# Altium schematic sheet mcu.SchDoc
size A; SheetNumber: 7; SheetTotal: 12
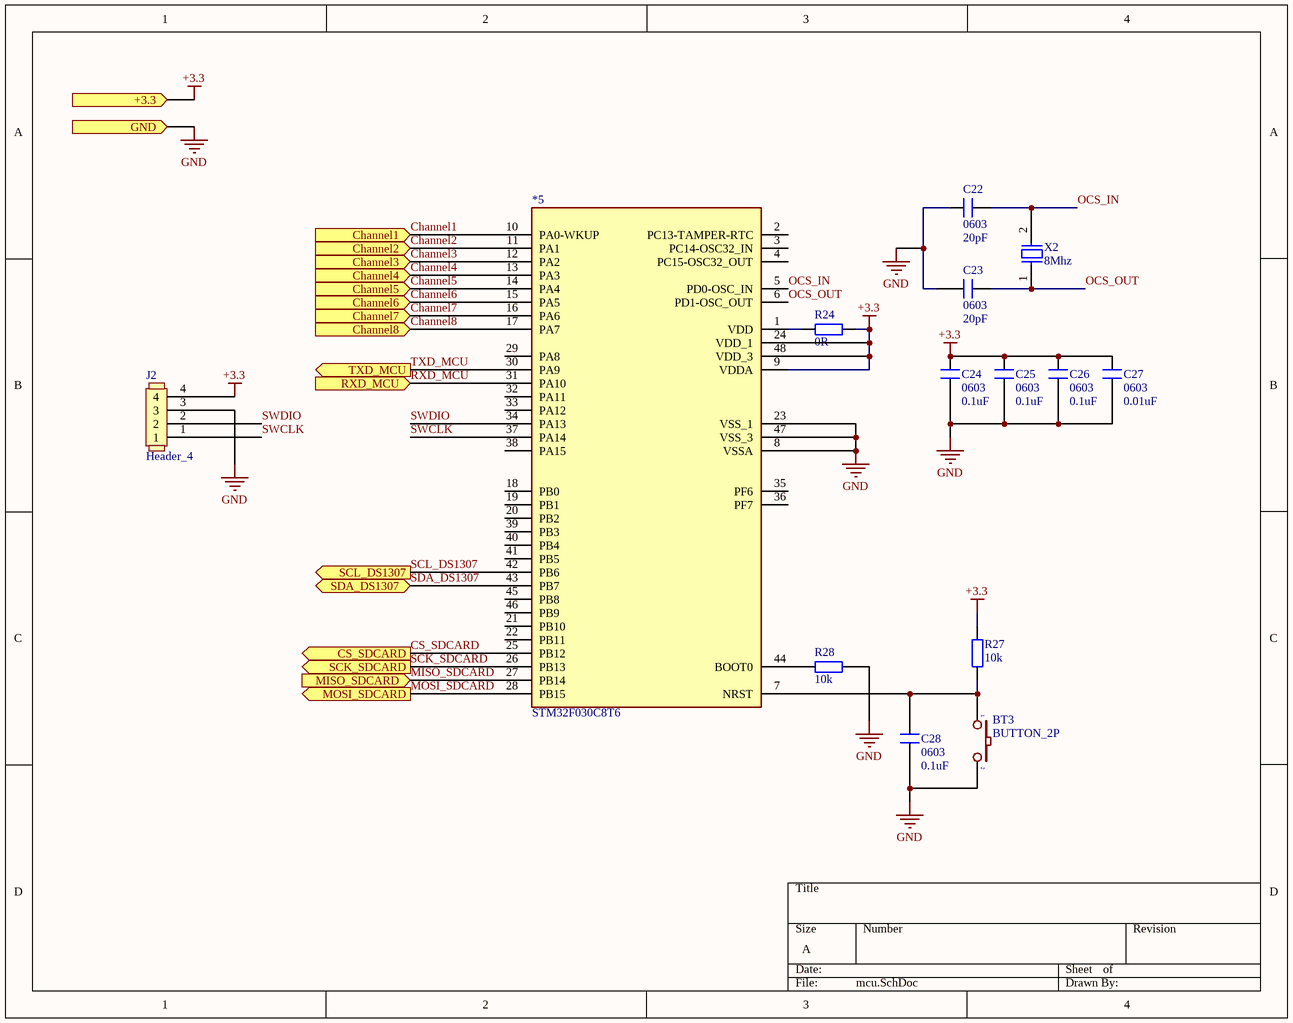
[diagram p0: mcu.SchDoc]

## Parts
*5  STM32F030C8T6  [STM32_LQPF48]
BT3  BUTTON_2P  [BUTTON_2P_SMD]
C22  0603  value 20pF  [C_0603]
C23  0603  value 20pF  [C_0603]
C24  0603  value 0.1uF  [C_0603]
C25  0603  value 0.1uF  [C_0603]
C26  0603  value 0.1uF  [C_0603]
C27  0603  value 0.01uF  [C_0603]
C28  0603  value 0.1uF  [C_0603]
J2  Header_4  [HEADER_4_2P54_SHROUDED]
R24  0R  [tro smd 0603]
R27  10k  [tro smd 0805]
R28  10k  [tro smd 0805]
X2  8Mhz  [XTAL_SMD_3P5]

## Ports
+3.3 (in), Channel1 (in), Channel2 (in), Channel3 (in), Channel4 (in), Channel5 (in), Channel6 (in), Channel7 (in), Channel8 (in), CS_SDCARD (out), GND (in), MISO_SDCARD (in), MOSI_SDCARD (out), RXD_MCU (in), SCK_SDCARD (out), SCL_DS1307 (out), SDA_DS1307 (bidir), TXD_MCU (out)

## Nets
+3.3: *5.9(VDDA) *5.24(VDD_1) *5.48(VDD_3) C24.2 C25.2 C26.2 C27.2 J2.4 R24.1 R27.2 ; port +3.3
GND: *5.8(VSSA) *5.23(VSS_1) *5.47(VSS_3) BT3.2 C22.2 C23.2 C24.1 C25.1 C26.1 C27.1 C28.1 J2.3 R28.1 ; port GND
Channel1: *5.10(PA0-WKUP) ; port Channel1
Channel2: *5.11(PA1) ; port Channel2
Channel3: *5.12(PA2) ; port Channel3
Channel4: *5.13(PA3) ; port Channel4
Channel5: *5.14(PA4) ; port Channel5
Channel6: *5.15(PA5) ; port Channel6
Channel7: *5.16(PA6) ; port Channel7
Channel8: *5.17(PA7) ; port Channel8
CS_SDCARD: *5.25(PB12) ; port CS_SDCARD
MISO_SDCARD: *5.27(PB14) ; port MISO_SDCARD
MOSI_SDCARD: *5.28(PB15) ; port MOSI_SDCARD
OCS_IN: *5.5(PD0-OSC_IN) C22.1 X2.2
OCS_OUT: *5.6(PD1-OSC_OUT) C23.1 X2.1
RXD_MCU: *5.31(PA10) ; port RXD_MCU
SCK_SDCARD: *5.26(PB13) ; port SCK_SDCARD
SCL_DS1307: *5.42(PB6) ; port SCL_DS1307
SDA_DS1307: *5.43(PB7) ; port SDA_DS1307
SWCLK: *5.37(PA14) J2.1
SWDIO: *5.34(PA13) J2.2
TXD_MCU: *5.30(PA9) ; port TXD_MCU
Net*5_1: *5.1(VDD) R24.2
Net*5_7: *5.7(NRST) BT3.1 C28.2 R27.1
Net*5_44: *5.44(BOOT0) R28.2

Not connected (* = marked no-connect by the designer): *5 2(PC13-TAMPER-RTC) 3(PC14-OSC32_IN) 4(PC15-OSC32_OUT) 18(PB0) 19(PB1) 20(PB2) 21(PB10) 22(PB11) 29(PA8) 32(PA11) 33(PA12) 35(PF6) 36(PF7) 38(PA15) 39(PB3) 40(PB4) 41(PB5) 45(PB8) 46(PB9)

## Library data of the parts
BT3 = BUTTON_2P: Manufacturer: C&K; Part Number: PTS636 SM25F SMTR LFS; Part Code: S2000-000001; Point: 2; Value: BUTTON_2P; Description SEL: BUTTON_2P; Footprint Type: TH
C22 C23 = Cap_Cer_0603_18pF: Ceramic Capacitor 0603  (+-10% TH)/(+10%SMD); Manufacturer: Murata Electronics; Part Number: GRM1885C1H180JA01J; Part Code: S1200-000093; Description SEL: CAP CER 18PF 50V C0G/NP0 0603; Point: 2; Footprint Type: SMD
C24-C28 = Cap_Cer_0603_0.1uF_25V: Ceramic Capacitor 0603  (+-10% TH)/(+10%SMD); Manufacturer: Murata Electronics; Part Number: GCM188R91E104KA37J; Part Code: S1200-000077; Description SEL: CAP CER 0.1UF 25V X8R 0603; Point: 2; Footprint Type: SMD
J2 = Header_4: Part Code: S1900-000023; Point: 4; Manufacturer: *; Part Number: *; Value: *; Description SEL: Header_4; Footprint Type: TH
R24 = Tro 0805 5% 0R: Dán; Don_Vi: Con; So_Chan: 2; Ten_Linh_Kien: Trở 0805 5% 0R; Ma_Hang: MH005230; Chung_Loai: Dán; Kieu_Chan: *
R27 R28 = Tro 0805 5% 10k: Dán; Don_Vi: Con; So_Chan: 2; Ten_Linh_Kien: Trở 0805 5% 10k; Ma_Hang: MH005239; Chung_Loai: Dán; Kieu_Chan: *
X2 = Xtal_2P_SMD_5P0X3P5_8Mhz: Use for 8Mhz; Manufacturer: WTL; Part Number: WTL5G11651; Part Code: S1600-000001; Description SEL: CRYSTAL 8.0000MHZ SURFACE MOUNT; Point: 2; Value: 8Mhz; Footprint Type: SMD